# Altium project RC.PrjPcb
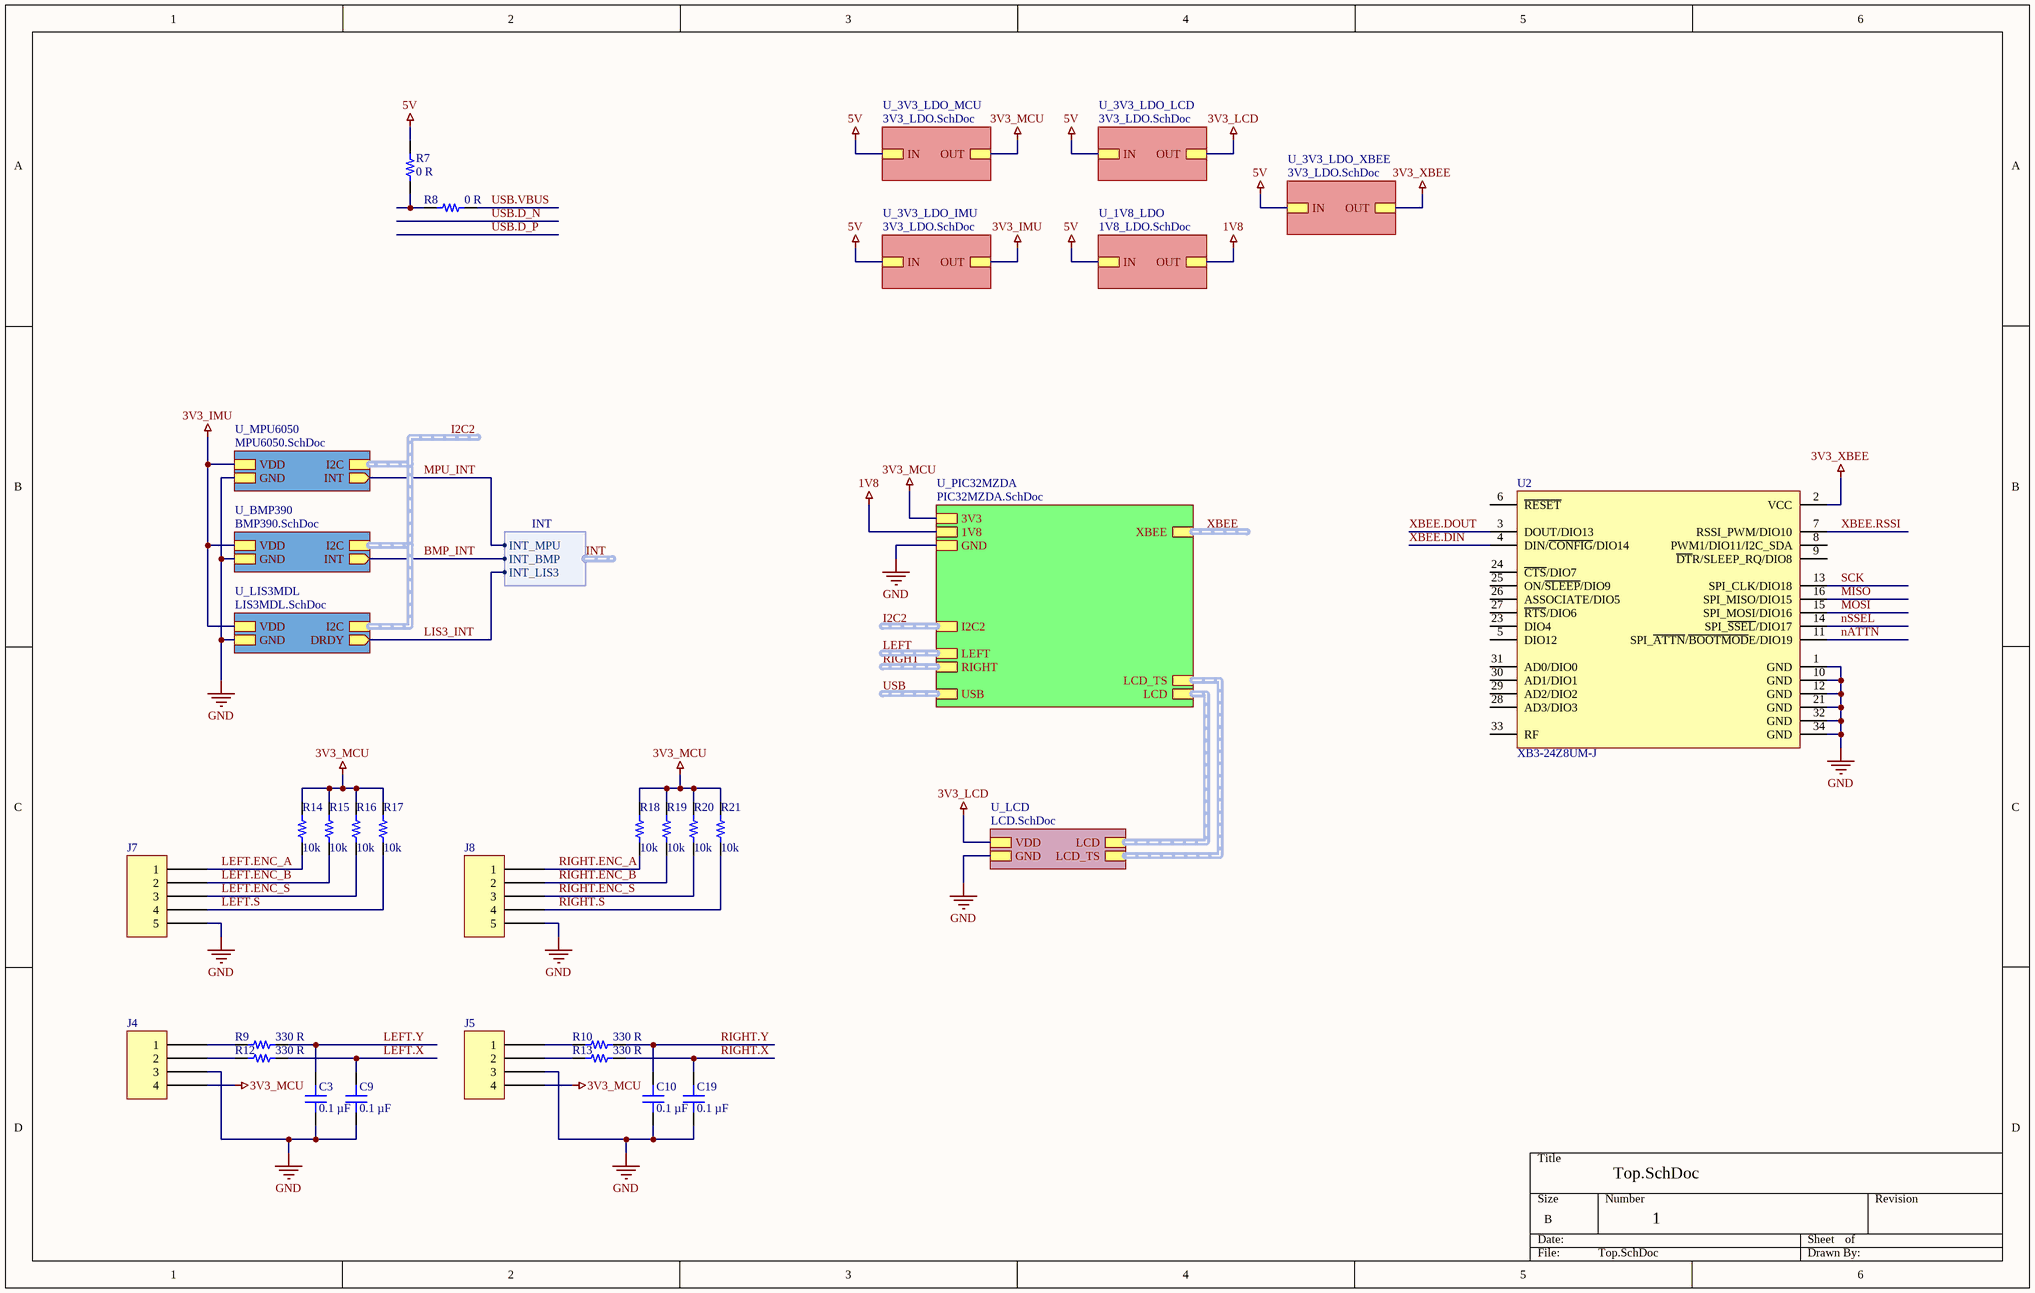
[diagram p0: Top.SchDoc]
5 sheets, 53 parts. Net scope: hierarchical (ports join the sheet entries above them; power ports are global).
Board file: RC.PcbDoc
Sheets:
  Top.SchDoc
    U_3V3_LDO_MCU = 3V3_LDO.SchDoc
    U_LCD = LCD.SchDoc
    U_3V3_LDO_LCD = 3V3_LDO.SchDoc
    U_MPU6050 = MPU6050.SchDoc
    U_3V3_LDO_IMU = 3V3_LDO.SchDoc
    U_3V3_LDO_XBEE = 3V3_LDO.SchDoc
  5V_BOOST.SchDoc

## Sheet Top.SchDoc
size B; SheetNumber: 1; SheetTotal: 9

### Parts
C3  0.1 µF  [CAP 0402_1005]
C9  0.1 µF  [CAP 0402_1005]
C10  0.1 µF  [CAP 0402_1005]
C19  0.1 µF  [CAP 0402_1005]
J4  BM04B-SRSS-TB(LF)(SN)  [JST BM04B-SRSS-TB]  (value not drawn)
J5  BM04B-SRSS-TB(LF)(SN)  [JST BM04B-SRSS-TB]  (value not drawn)
J7  SM05B-SRSS-TB(LF)(SN)  [JST SM05B-SRSS-TB]  (value not drawn)
J8  SM05B-SRSS-TB(LF)(SN)  [JST SM05B-SRSS-TB]  (value not drawn)
R7  0 R  [RES 0603_1608]
R8  0 R  [RES 0402_1005]
R9  330 R  [RES 0402_1005]
R10  330 R  [RES 0402_1005]
R12  330 R  [RES 0402_1005]
R13  330 R  [RES 0402_1005]
R14  10k  [RES 0402_1005]
R15  10k  [RES 0402_1005]
R16  10k  [RES 0402_1005]
R17  10k  [RES 0402_1005]
R18  10k  [RES 0402_1005]
R19  10k  [RES 0402_1005]
R20  10k  [RES 0402_1005]
R21  10k  [RES 0402_1005]
U2  XB3-24Z8UM-J  [XCVR_XB3-24Z8UM-J]

### Sub-sheets
U_1V8_LDO = 1V8_LDO.SchDoc (file not in this document): OUT, IN
U_3V3_LDO_IMU = 3V3_LDO.SchDoc: OUT, IN
U_3V3_LDO_LCD = 3V3_LDO.SchDoc: OUT, IN
U_3V3_LDO_MCU = 3V3_LDO.SchDoc: OUT, IN
U_3V3_LDO_XBEE = 3V3_LDO.SchDoc: OUT, IN
U_BMP390 = BMP390.SchDoc (file not in this document): VDD, GND, I2C (harness I2C), INT (out)
U_LCD = LCD.SchDoc: VDD, GND, LCD (harness LCD), LCD_TS (harness LCD_TS)
U_LIS3MDL = LIS3MDL.SchDoc (file not in this document): VDD, GND, I2C (harness I2C), DRDY (out)
U_MPU6050 = MPU6050.SchDoc: VDD, GND, I2C (harness I2C), INT (out)
U_PIC32MZDA = PIC32MZDA.SchDoc (file not in this document): 1V8, GND, 3V3, LCD (harness LCD), USB (harness USB), I2C2 (harness I2C), LCD_TS (harness LCD_TS), LEFT (harness INPUT), RIGHT (harness INPUT), XBEE (harness XBEE)

### Harnesses
INT: INT_MPU, INT_BMP, INT_LIS3

### Nets
1V8: sheet U_PIC32MZDA/1V8, sheet U_1V8_LDO/OUT
3V3_IMU: sheet U_MPU6050/VDD, sheet U_LIS3MDL/VDD, sheet U_BMP390/VDD, sheet U_3V3_LDO_IMU/OUT
3V3_LCD: sheet U_LCD/VDD, sheet U_3V3_LDO_LCD/OUT
3V3_MCU: J4.4 J5.4 R14.1 R15.1 R16.1 R17.1 R18.1 R19.1 R20.1 R21.1 ; sheet U_3V3_LDO_MCU/OUT, sheet U_PIC32MZDA/3V3
3V3_XBEE: U2.2(VCC) ; sheet U_3V3_LDO_XBEE/OUT
5V: R7.2 ; sheet U_3V3_LDO_MCU/IN, sheet U_3V3_LDO_LCD/IN, sheet U_1V8_LDO/IN, sheet U_3V3_LDO_IMU/IN, sheet U_3V3_LDO_XBEE/IN
GND: C3.1 C9.1 C10.1 C19.1 J4.3 J5.3 J7.5 J8.5 U2.1(GND) U2.10(GND) U2.12(GND) U2.21(GND) U2.32(GND) U2.34(GND) ; sheet U_PIC32MZDA/GND, sheet U_LCD/GND, sheet U_MPU6050/GND, sheet U_LIS3MDL/GND, sheet U_BMP390/GND
BMP_INT: sheet U_BMP390/INT, harness INT.INT_BMP
LEFT.ENC_A: J7.1 R14.2
LEFT.ENC_B: J7.2 R15.2
LEFT.ENC_S: J7.3 R16.2
LEFT.S: J7.4 R17.2
LEFT.X: C9.2 R12.1
LEFT.Y: C3.2 R9.1
LIS3_INT: sheet U_LIS3MDL/DRDY, harness INT.INT_LIS3  [project net INT.INT_LIS3]
MISO: U2.16(SPI_MISO/DIO15)
MOSI: U2.15(SPI_MOSI/DIO16)
MPU_INT: sheet U_MPU6050/INT, harness INT.INT_MPU  [project net INT.INT_MPU]
nATTN: U2.11(SPI_~{ATTN}/~{BOOTMOD}E/DIO19)
nSSEL: U2.14(SPI_~{SSEL}/DIO17)
RIGHT.ENC_A: J8.1 R18.2
RIGHT.ENC_B: J8.2 R19.2
RIGHT.ENC_S: J8.3 R20.2
RIGHT.S: J8.4 R21.2
RIGHT.X: C19.2 R13.1
RIGHT.Y: C10.2 R10.1
SCK: U2.13(SPI_CLK/DIO18)
USB.VBUS: R8.1
XBEE.DIN: U2.4(DIN/~{CONFIG}/DIO14)
XBEE.DOUT: U2.3(DOUT/DIO13)
XBEE.RSSI: U2.7(RSSI_PWM/DIO10)
NetJ4_1: J4.1 R9.2
NetJ4_2: J4.2 R12.2
NetJ5_1: J5.1 R10.2
NetJ5_2: J5.2 R13.2
NetR7_1: R7.1 R8.2

Not connected (* = marked no-connect by the designer): U2 5(DIO12) 6(~{RESET}) 8(PWM1/DIO11/I2C_SDA) 9(~{DT}R/SLEEP_RQ/DIO8) 23(DIO4) 24(~{CTS}/DIO7) 25(ON/~{SLEEP}/DIO9) 26(ASSOCIATE/DIO5) 27(~{RTS}/DIO6) 28(AD3/DIO3) 29(AD2/DIO2) 30(AD1/DIO1) 31(AD0/DIO0) 33(RF)

### Buses and harness runs
harness I2C2 = sheet U_BMP390/I2C = sheet U_LIS3MDL/I2C = sheet U_MPU6050/I2C
harness I2C2 = sheet U_PIC32MZDA/I2C2
harness LEFT = sheet U_PIC32MZDA/LEFT
harness RIGHT = sheet U_PIC32MZDA/RIGHT
harness sheet U_LCD/LCD = sheet U_PIC32MZDA/LCD
harness sheet U_LCD/LCD_TS = sheet U_PIC32MZDA/LCD_TS
harness USB = sheet U_PIC32MZDA/USB
harness XBEE = sheet U_PIC32MZDA/XBEE

### Library data of the parts
C3 C9 C10 C19 = C0402C104K4RACAUTO: CAP CER 0.1UF 16V X7R 0402; manufacturer: KEMET; Tolerance: ±10%; Part Number: C0402C104K4RACAUTO; Value: 0.1 µF; Applications: Automotive, Bypass, Decoupling; Capacitance: 0.1 µF; componentlink1description: Datasheet; componentlink1url: https://api.kemet.com/component-edge/download/specsheet/C0402C104K4RACAUTO.pdf; componentlink2description: DigiKey Link; componentlink2url: https://www.digikey.com/en/products/detail/kemet/C0402C104K4RACAUTO/3314827; Device Package: 0402 (1005 Metric); lastupdated: 8/14/2022 9:05:51 PM; Lifecycle Status: Active; Minimum Order: 1; Mounting Type: Surface Mount, MLCC; Operating Temperature: -55°C ~ 125°C; Package / Case: 0402 (1005 Metric); packaging: TapeAndReel; partid: 3024; Part Status: Active; price: 0.01; Ratings: AEC-Q200; series: SMD Auto X7R; Size / Dimension: 0.039" L x 0.020" W (1.00mm x 0.50mm); Supplier 1: DigiKey; Supplier Part Number 1: 399-6828-1-ND; Temperature Coefficient: X7R; Thickness (Max): 0.022" (0.55mm); Voltage - Rated: 16V
J4 J5 = BM04B-SRSS-TB(LF)(SN): CONN HEADER SMD 4POS 1MM; Manufacturer: JST Sales America Inc.; Current Rating (Amps): 0.7A; Material Flammability Rating: UL94 V-0; Number of Positions: 4; Number of Positions Loaded: All; Pitch - Mating: 0.039" (1.00mm); Row Spacing - Mating: -25°C ~ 85°C; Shrouding: Shrouded - 4 Wall; Style: Board to Cable/Wire; Voltage Rating: 50V; Part Number: BM04B-SRSS-TB(LF)(SN); ComponentLink1Description: Datasheet; ComponentLink1URL: http://www.jst-mfg.com/product/pdf/eng/eSH.pdf; ComponentLink2Description: DigiKey Link; ComponentLink2URL: http://digikey.com/product-detail/en/jst-sales-america-inc/BM04B-SRSS-TB-LF-SN/455-1790-1-ND/926861; Connector Type: Header; Contact Finish - Mating: Tin; Contact Finish - Post: Tin; Contact Material: Copper Alloy; Contact Shape: Square; Contact Type: Male Pin; Fastening Type: Push-Pull; Features: Solder Retention; Insulation Color: Natural; Insulation Height: 0.167" (4.25mm); Insulation Material: Polyamide (PA), Nylon; LastUpdated: 8/24/2020 1:45:53 PM; Lifecycle Status: Active; Minimum Order: 1; Mounting Type: Surface Mount; Number of Rows: 1; Operating Temperature: -25°C ~ 85°C; Packaging: TapeAndReel; PartId: 16; Part Status: Active; Price: 0.29; Series: SR; Supplier 1: DigiKey; Supplier Part Number 1: 455-1790-1-ND; Termination: Solder
J7 J8 = SM05B-SRSS-TB(LF)(SN): CONN HEADER SMD R/A 5POS 1MM; Manufacturer: JST Sales America Inc.; Current Rating (Amps): 0.7A; Material Flammability Rating: UL94 V-0; Number of Positions: 5; Number of Positions Loaded: All; Pitch - Mating: 0.039" (1.00mm); Shrouding: Shrouded - 4 Wall; Style: Board to Cable/Wire; Voltage Rating: 50V; Part Number: SM05B-SRSS-TB(LF)(SN); ComponentLink1Description: Datasheet; ComponentLink1URL: http://www.jst-mfg.com/product/pdf/eng/eSH.pdf; ComponentLink2Description: DigiKey Link; ComponentLink2URL: http://digikey.com/product-detail/en/jst-sales-america-inc/SM05B-SRSS-TB-LF-SN/455-1805-1-ND/926876; Connector Type: Header; Contact Finish - Mating: Tin; Contact Finish - Post: Tin; Contact Material: Copper Alloy; Contact Shape: Square; Contact Type: Male Pin; Fastening Type: Push-Pull; Features: Solder Retention; Insulation Color: Natural; Insulation Height: 0.114" (2.90mm); Insulation Material: Polyamide (PA), Nylon; LastUpdated: 1/12/2020 11:42:04 PM; Lifecycle Status: Active; Minimum Order: 1; Mounting Type: Surface Mount, Right Angle; Number of Rows: 1; Operating Temperature: -25°C ~ 85°C; Packaging: TapeAndReel; PartId: 63; Part Status: Active; Price: 0.32; Series: SR; Supplier 1: DigiKey; Supplier Part Number 1: 455-1805-1-ND; Termination: Solder
R7 = RNCS0603BKE10K0: RES 10K OHM 0.1% 1/16W 0603; Manufacturer: Stackpole Electronics Inc; Power (Watts): 0.063W, 1/16W; Resistance: 10 kOhms; Temperature Coefficient: ±25ppm/°C; Part Number: RNCS0603BKE10K0; Value: 0 R; ComponentLink1Description: Datasheet; ComponentLink1URL: https://www.seielect.com/catalog/sei-rncs_rnch.pdf; ComponentLink2Description: DigiKey Link; ComponentLink2URL: https://www.digikey.com/en/products/detail/stackpole-electronics-inc/RNCS0603BKE10K0/1708836; Composition: Thin Film; Device Package: 0603 (1608 Metric); Features: Anti-Corrosive, Automotive AEC-Q200, Moisture Resistant; Height - Seated (Max): 0.022" (0.55mm); LastUpdated: 9/19/2022 1:22:34 PM; Lifecycle Status: Active; Minimum Order: 1; Number of Terminations: 2; Operating Temperature: -55°C ~ 155°C; Package / Case: 0603 (1608 Metric); Packaging: TapeAndReel; PartId: 4838; Part Status: Active; Price: 0.07; Ratings: AEC-Q200; Series: RNCS; Size / Dimension: 0.061" L x 0.031" W (1.55mm x 0.80mm); Supplier 1: DigiKey; Supplier Part Number 1: RNCS0603BKE10K0CT-ND; Supplier Device Package: 0603; Tolerance: ±0.1%
R8-R10 R12-R21 = CRCW0402330RJNEDC: RES 330 OHM 5% 1/16W 0402; Manufacturer: Vishay Dale; Power (Watts): 0.063W, 1/16W; Resistance: 330 Ohms; Temperature Coefficient: ±200ppm/°C; Part Number: CRCW0402330RJNEDC; ComponentLink1Description: Datasheet; ComponentLink1URL: http://www.vishay.com/docs/28773/crcwce3.pdf; ComponentLink2Description: DigiKey Link; ComponentLink2URL: https://www.digikey.com/en/products/detail/vishay-dale/CRCW0402330RJNEDC/7928545; Composition: Thick Film; Device Package: 0402 (1005 Metric); Height - Seated (Max): 0.014" (0.35mm); LastUpdated: 8/14/2022 9:23:31 PM; Lifecycle Status: Active; Minimum Order: 1; Number of Terminations: 2; Operating Temperature: -55°C ~ 155°C; Package / Case: 0402 (1005 Metric); Packaging: CutTape; PartId: 15989; Part Status: Active; Price: 0.01; Series: CRCW-C; Size / Dimension: 0.039" L x 0.020" W (1.00mm x 0.50mm); Supplier 1: DigiKey; Supplier Part Number 1: 541-4123-1-ND; Supplier Device Package: 0402; Tolerance: ±5%
  R8: Value: 0 R
  R9 R10 R12 R13: Value: 330 R
  R14-R21: Value: 10k
U2 = XB3-24Z8UM-J: 802.15.4 Zigbee Transceiver Module 2.4GHz Antenna Not Included, U.FL Surface Mount; MF: Digi International; Availability: Unavailable; MP: XB3-24Z8UM-J; Value: *; SnapEDA_Link: https://www.snapeda.com/parts/XB3-24Z8UM-J/Digi%20International/view-part/2762908/?ref=snap; Price: None; Package: SMD-34 Digi International

## Sheet 3V3_LDO.SchDoc
size A; SheetNumber: 3; SheetTotal: 9
Used 4 times, as channels U_3V3_LDO_MCU, U_3V3_LDO_LCD, U_3V3_LDO_IMU, U_3V3_LDO_XBEE. Parts and nets are listed once, with the designators drawn on the sheet.
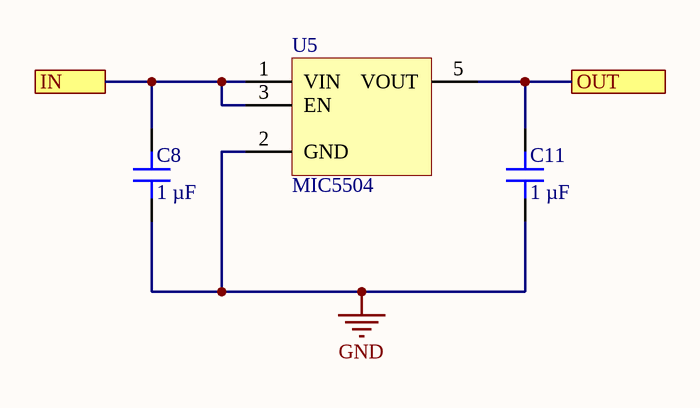
[diagram p1: 3V3_LDO.SchDoc]

### Parts
C8  1 µF  [CAP 0402_1005]
C11  1 µF  [CAP 0402_1005]
U5  MIC5504  [TI SOT-23-5 DBV]

### Ports
IN, OUT

### Nets
GND: C8.1 C11.1 U5.2(GND)
IN: C8.2 U5.1(VIN) U5.3(EN) ; port IN
OUT: C11.2 U5.5(VOUT) ; port OUT

### Channels
U_3V3_LDO_MCU: designators end in _2#1; ports IN=5V OUT=3V3_MCU
U_3V3_LDO_LCD: designators end in _2#2; ports IN=5V OUT=3V3_LCD
U_3V3_LDO_IMU: designators end in _1; ports IN=5V OUT=3V3_IMU
U_3V3_LDO_XBEE: designators end in _4; ports IN=5V OUT=3V3_XBEE

### Library data of the parts
C8 C11 = C0402C104K4RACAUTO: CAP CER 0.1UF 16V X7R 0402; manufacturer: KEMET; Capacitance: 0.1 µF; Tolerance: ±10%; Part Number: C0402C104K4RACAUTO; Value: 1 µF; Applications: Automotive, Bypass, Decoupling; componentlink1description: Datasheet; componentlink1url: https://api.kemet.com/component-edge/download/specsheet/C0402C104K4RACAUTO.pdf; componentlink2description: DigiKey Link; componentlink2url: https://www.digikey.com/en/products/detail/kemet/C0402C104K4RACAUTO/3314827; Device Package: 0402 (1005 Metric); lastupdated: 8/14/2022 9:05:51 PM; Lifecycle Status: Active; Minimum Order: 1; Mounting Type: Surface Mount, MLCC; Operating Temperature: -55°C ~ 125°C; Package / Case: 0402 (1005 Metric); packaging: TapeAndReel; partid: 3024; Part Status: Active; price: 0.01; Ratings: AEC-Q200; series: SMD Auto X7R; Size / Dimension: 0.039" L x 0.020" W (1.00mm x 0.50mm); Supplier 1: DigiKey; Supplier Part Number 1: 399-6828-1-ND; Temperature Coefficient: X7R; Thickness (Max): 0.022" (0.55mm); Voltage - Rated: 16V
U5 = MIC5504-3.3YM5: 3.3V LDO

## Sheet LCD.SchDoc
size A; SheetNumber: 7; SheetTotal: 9
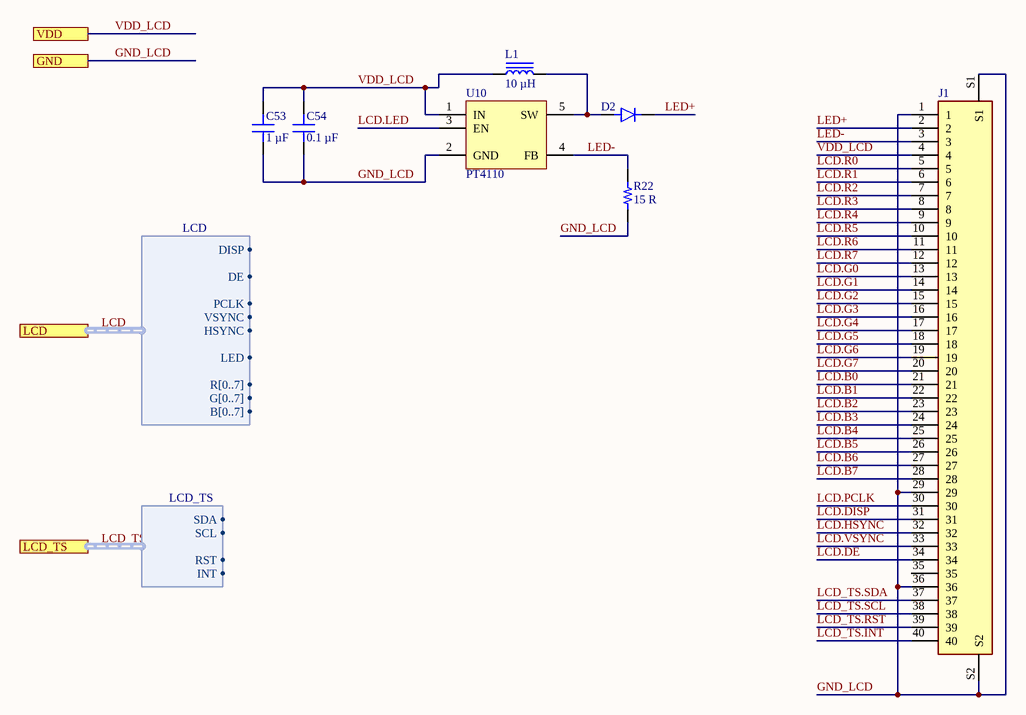
[diagram p2: LCD.SchDoc]

### Parts
C53  1 µF  [CAP 0402_1005]
C54  0.1 µF  [CAP 0402_1005]
D2  Diode  [Diode DFN1608D-2 (SOD1608)]  (value not drawn)
J1  40pin_0.5mm_ZIF  [40pin_0.5mmPitch]  (value not drawn)
L1  10 µH  [IND 0806_2016]
R22  15 R  [RES 0603_1608]
U10  PT4110  [SOT-89-5]

### Ports
GND, LCD (harness LCD), LCD_TS (harness LCD_TS), VDD

### Harnesses
LCD: PCLK, DISP, VSYNC, HSYNC, DE, LED, R[0..7], G[0..7], B[0..7]
LCD_TS: INT, RST, SCL, SDA

### Nets
GND_LCD: C53.1 C54.1 J1.1 J1.29 J1.36 J1.S1 J1.S2 R22.2 U10.2(GND) ; port GND  [project net GND]
VDD_LCD: C53.2 C54.2 J1.4 L1.1 U10.1(IN) ; port VDD  [project net 3V3_LCD]
LCD.B0: J1.21
LCD.B1: J1.22
LCD.B2: J1.23
LCD.B3: J1.24
LCD.B4: J1.25
LCD.B5: J1.26
LCD.B6: J1.27
LCD.B7: J1.28
LCD.DE: J1.34
LCD.DISP: J1.31
LCD.G0: J1.13
LCD.G1: J1.14
LCD.G2: J1.15
LCD.G3: J1.16
LCD.G4: J1.17
LCD.G5: J1.18
LCD.G6: J1.19
LCD.G7: J1.20
LCD.HSYNC: J1.32
LCD.LED: U10.3(EN)
LCD.PCLK: J1.30
LCD.R0: J1.5
LCD.R1: J1.6
LCD.R2: J1.7
LCD.R3: J1.8
LCD.R4: J1.9
LCD.R5: J1.10
LCD.R6: J1.11
LCD.R7: J1.12
LCD.VSYNC: J1.33
LCD_TS.INT: J1.40
LCD_TS.RST: J1.39
LCD_TS.SCL: J1.38
LCD_TS.SDA: J1.37
LED+: D2.1(A) J1.2
LED-: J1.3 R22.1 U10.4(FB)
NetD2_2: D2.2(BLUE(C)) L1.2 U10.5(SW)

Not connected (* = marked no-connect by the designer): J1 35

### Buses and harness runs
harness LCD = port LCD
harness LCD_TS = port LCD_TS

### Library data of the parts
C53 = C0402C104K4RACAUTO: as C8 on sheet 3V3_LDO; Part Number: C0402C104K4RACAUTO; Value: 1 µF; Applications: Automotive, Bypass, Decoupling; componentlink1description: Datasheet; componentlink1url: https://api.kemet.com/component-edge/download/specsheet/C0402C104K4RACAUTO.pdf; componentlink2description: DigiKey Link; componentlink2url: https://www.digikey.com/en/products/detail/kemet/C0402C104K4RACAUTO/3314827; Device Package: 0402 (1005 Metric); lastupdated: 8/14/2022 9:05:51 PM; Lifecycle Status: Active; Minimum Order: 1; Mounting Type: Surface Mount, MLCC; Operating Temperature: -55°C ~ 125°C; Package / Case: 0402 (1005 Metric); packaging: TapeAndReel; partid: 3024; Part Status: Active; price: 0.01; Ratings: AEC-Q200; series: SMD Auto X7R; Size / Dimension: 0.039" L x 0.020" W (1.00mm x 0.50mm); Supplier 1: DigiKey; Supplier Part Number 1: 399-6828-1-ND; Temperature Coefficient: X7R; Thickness (Max): 0.022" (0.55mm); Voltage - Rated: 16V
C54 = C0402C104K4RACAUTO: as C3 on sheet Top; Part Number: C0402C104K4RACAUTO; Value: 0.1 µF; Applications: Automotive, Bypass, Decoupling; Capacitance: 0.1 µF; componentlink1description: Datasheet; componentlink1url: https://api.kemet.com/component-edge/download/specsheet/C0402C104K4RACAUTO.pdf; componentlink2description: DigiKey Link; componentlink2url: https://www.digikey.com/en/products/detail/kemet/C0402C104K4RACAUTO/3314827; Device Package: 0402 (1005 Metric); lastupdated: 8/14/2022 9:05:51 PM; Lifecycle Status: Active; Minimum Order: 1; Mounting Type: Surface Mount, MLCC; Operating Temperature: -55°C ~ 125°C; Package / Case: 0402 (1005 Metric); packaging: TapeAndReel; partid: 3024; Part Status: Active; price: 0.01; Ratings: AEC-Q200; series: SMD Auto X7R; Size / Dimension: 0.039" L x 0.020" W (1.00mm x 0.50mm); Supplier 1: DigiKey; Supplier Part Number 1: 399-6828-1-ND; Temperature Coefficient: X7R; Thickness (Max): 0.022" (0.55mm); Voltage - Rated: 16V
D2 = Diode: DFN1608D-2 (SOD1608); Manufacturer: Cree; ComponentLink2Description: Datasheet; Temperature: -40°C to +100°C; Package: LED_3MM2X2MM8; Supplier 2: Mouser; Price: 0.203999996142; Supplier 1: Digi-Key; ComponentLink1URL: https://upverter.com/upn/revision/9d0b31f7b1982705/; Supplier Part Number 2: 941-CLV1LFKBC7673673; Supplier Part Number 1: CLV1L-FKB-CHMMQEHBB7673673-ND; ComponentLink1Description: Upverter; ComponentLink2URL: http://www.cree.com/~/media/Files/Cree/LED-Components-and-Modules/HB/Data-Sheets/CLV1L-FKB-1238.pdf; RoHS: TRUE; Mouser Part Number: 941-CLV1LFKBC7673673; Temperature Range High: +100°C; Digikey Description: DIODE LED RGB DIFFUSED 4LCC SMD; Digikey Part Number: CLV1L-FKB-CHMMQEHBB7673673-ND; Lead Free: yes; Temperature Range Low: -40°C
J1 = 40pin_0.5mm_ZIF: 40 Position FFC, FPC Connector Contacts, Top 0.020 _0.50mm_ Surface Mount, Right Angle; MP: FH12A-40S-0.5SH_55_; MF: Hirose; Price: None; SnapEDA_Link: https://www.snapeda.com/parts/FH12A-40S-0.5SH%2855%29/Hirose%20Electric%20Co%20Ltd/view-part/447132/?ref=snap; Package: None; Availability: Unavailable; Value: *
L1 = TYA201610100M-10: FIXED IND 10UH 600MA 875MOHM SMD; Manufacturer: Laird-Signal Integrity Products; DC Resistance (DCR): 875mOhm Max; Inductance Frequency - Test: 1 MHz; Material - Core: Metal; Shielding: Shielded; Tolerance: ±20%; Type: Drum Core, Wirewound; Part Number: TYA201610100M-10; ComponentLink1Description: Datasheet; ComponentLink1URL: https://www.laird.com/sites/default/files/2020-05/TYA201610%20series%20%28Rev%20A%29.pdf; ComponentLink2Description: DigiKey Link; ComponentLink2URL: https://www.digikey.com/en/products/detail/laird-signal-integrity-products/TYA201610100M-10/12664143; Current Rating (Amps): 600 mA; Device Package: 0806 (2016 Metric); Height - Seated (Max): 0.045" (1.15mm); Inductance: 10 µH; LastUpdated: 9/19/2022 1:59:27 PM; Lifecycle Status: Active; Minimum Order: 1; Mounting Type: Surface Mount; Operating Temperature: -40°C ~ 125°C; Package / Case: 0806 (2016 Metric); Packaging: TapeAndReel; PartId: 5377; Part Status: Active; Price: 0.12; Ratings: AEC-Q200; Series: TYA201610; Size / Dimension: 0.079" L x 0.063" W (2.00mm x 1.60mm); Supplier 1: DigiKey; Supplier Part Number 1: 240-TYA201610100M-10CT-ND; Supplier Device Package: 0806; Value: 10 µH
R22 = RNCS0603BKE10K0: as R7 on sheet Top; Part Number: RNCS0603BKE10K0; Value: 15 R; ComponentLink1Description: Datasheet; ComponentLink1URL: https://www.seielect.com/catalog/sei-rncs_rnch.pdf; ComponentLink2Description: DigiKey Link; ComponentLink2URL: https://www.digikey.com/en/products/detail/stackpole-electronics-inc/RNCS0603BKE10K0/1708836; Composition: Thin Film; Device Package: 0603 (1608 Metric); Features: Anti-Corrosive, Automotive AEC-Q200, Moisture Resistant; Height - Seated (Max): 0.022" (0.55mm); LastUpdated: 9/19/2022 1:22:34 PM; Lifecycle Status: Active; Minimum Order: 1; Number of Terminations: 2; Operating Temperature: -55°C ~ 155°C; Package / Case: 0603 (1608 Metric); Packaging: TapeAndReel; PartId: 4838; Part Status: Active; Price: 0.07; Ratings: AEC-Q200; Series: RNCS; Size / Dimension: 0.061" L x 0.031" W (1.55mm x 0.80mm); Supplier 1: DigiKey; Supplier Part Number 1: RNCS0603BKE10K0CT-ND; Supplier Device Package: 0603; Tolerance: ±0.1%
U10 = PT4110: LED Backlight Driver

## Sheet MPU6050.SchDoc
size A; SheetNumber: 4; SheetTotal: 9
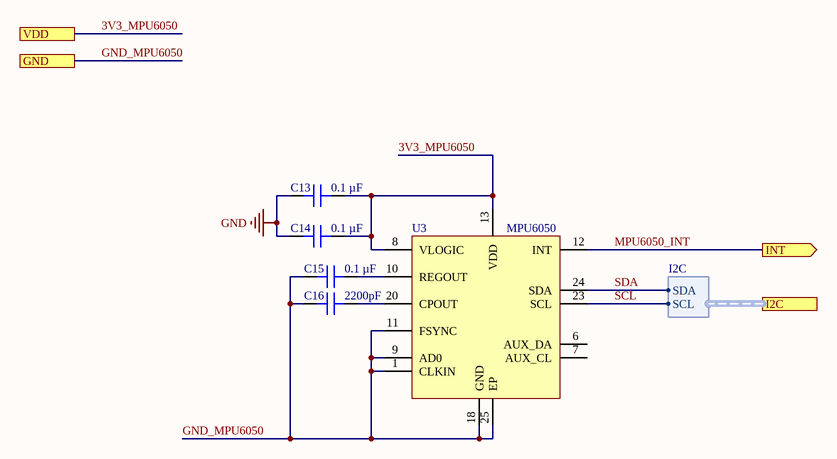
[diagram p3: MPU6050.SchDoc]

### Parts
C13  0.1 µF  [CAP 0402_1005]
C14  0.1 µF  [CAP 0402_1005]
C15  0.1 µF  [CAP 0402_1005]
C16  2200pF  [CAP 0603_1608]
U3  MPU6050  [IC_MPU6050]

### Ports
GND, I2C (harness I2C), INT (out), VDD

### Harnesses
I2C: SCL, SDA

### Nets
3V3_MPU6050: C13.1 C14.1 U3.8(VLOGIC) U3.13(VDD) ; port VDD  [project net 3V3_IMU]
GND: C13.2 C14.2 C15.2 C16.2 U3.1(CLKIN) U3.9(AD0) U3.11(FSYNC) U3.18(GND) U3.25(EP) ; port GND  [also labelled GND_MPU6050]
MPU6050_INT: U3.12(INT) ; port INT  [project net INT.INT_MPU]
SCL: U3.23(SCL) ; port I2C.SCL  [project net I2C2.SCL]
SDA: U3.24(SDA) ; port I2C.SDA  [project net I2C2.SDA]
NetC15_1: C15.1 U3.10(REGOUT)
NetC16_1: C16.1 U3.20(CPOUT)

Not connected (* = marked no-connect by the designer): U3 6(AUX_DA) 7(AUX_CL)

### Library data of the parts
C13-C15 = C0402C104K4RACAUTO: as C3 on sheet Top; Part Number: C0402C104K4RACAUTO; Value: 0.1 µF; Applications: Automotive, Bypass, Decoupling; Capacitance: 0.1 µF; componentlink1description: Datasheet; componentlink1url: https://api.kemet.com/component-edge/download/specsheet/C0402C104K4RACAUTO.pdf; componentlink2description: DigiKey Link; componentlink2url: https://www.digikey.com/en/products/detail/kemet/C0402C104K4RACAUTO/3314827; Device Package: 0402 (1005 Metric); lastupdated: 8/14/2022 9:05:51 PM; Lifecycle Status: Active; Minimum Order: 1; Mounting Type: Surface Mount, MLCC; Operating Temperature: -55°C ~ 125°C; Package / Case: 0402 (1005 Metric); packaging: TapeAndReel; partid: 3024; Part Status: Active; price: 0.01; Ratings: AEC-Q200; series: SMD Auto X7R; Size / Dimension: 0.039" L x 0.020" W (1.00mm x 0.50mm); Supplier 1: DigiKey; Supplier Part Number 1: 399-6828-1-ND; Temperature Coefficient: X7R; Thickness (Max): 0.022" (0.55mm); Voltage - Rated: 16V
C16 = CGA3E2X8R1H222M080AD: CAP CER 2200PF 50V 0603 EPOXY; Manufacturer: TDK Corporation; Temperature Coefficient: X8R; Tolerance: ±20%; Part Number: CGA3E2X8R1H222M080AD; Value: 2200pF; Applications: Automotive; Capacitance: 2200pF; ComponentLink1Description: Datasheet; ComponentLink1URL: https://product.tdk.com/info/en/catalog/datasheets/mlcc_automotive_epoxy_en.pdf?ref_disty=digikey; ComponentLink2Description: DigiKey Link; ComponentLink2URL: http://digikey.com/product-detail/en/tdk-corporation/CGA3E2X8R1H222M080AD/445-9890-1-ND/3931817; Device Package: 0603 (1608 Metric); Features: Epoxy Mountable; LastUpdated: 13-Aug-20 10:19:25 AM; Lifecycle Status: Active; Minimum Order: 1; Mounting Type: Surface Mount, MLCC, Epoxy; Operating Temperature: -55°C ~ 150°C; Package / Case: 0603 (1608 Metric); Packaging: TapeAndReel; PartId: 17643; Part Status: Active; Price: 0.05; Ratings: AEC-Q200; Series: CGA; Size / Dimension: 0.063" L x 0.031" W (1.60mm x 0.80mm); Supplier 1: DigiKey; Supplier Part Number 1: 445-9890-1-ND; Thickness (Max): 0.031" (0.80mm)

## Sheet 5V_BOOST.SchDoc
size A; SheetNumber: 8; SheetTotal: 9
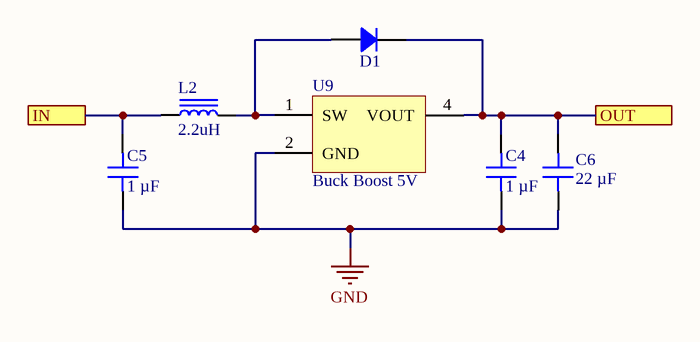
[diagram p4: 5V_BOOST.SchDoc]

### Parts
C4  1 µF  [CAP 0402_1005]
C5  1 µF  [CAP 0402_1005]
C6  22 µF  [CAP 0805_2012]
D1  V1F6-M3/H  [SMF DO-219AB]  (value not drawn)
L2  2.2uH  [TAIYO YUDEN MAMK2520T1R0M]
U9  Buck Boost 5V  [TI SOT-23-5 DBV]

### Ports
IN, OUT

### Nets
GND: C4.1 C5.1 C6.1 U9.2(GND)
IN: C5.2 L2.1 ; port IN
OUT: C4.2 C6.2 D1.2 U9.4(VOUT) ; port OUT
NetD1_1: D1.1 L2.2 U9.1(SW)

### Library data of the parts
C4 C5 = C0402C104K4RACAUTO: as C8 on sheet 3V3_LDO; Part Number: C0402C104K4RACAUTO; Value: 1 µF; Applications: Automotive, Bypass, Decoupling; componentlink1description: Datasheet; componentlink1url: https://api.kemet.com/component-edge/download/specsheet/C0402C104K4RACAUTO.pdf; componentlink2description: DigiKey Link; componentlink2url: https://www.digikey.com/en/products/detail/kemet/C0402C104K4RACAUTO/3314827; Device Package: 0402 (1005 Metric); lastupdated: 8/14/2022 9:05:51 PM; Lifecycle Status: Active; Minimum Order: 1; Mounting Type: Surface Mount, MLCC; Operating Temperature: -55°C ~ 125°C; Package / Case: 0402 (1005 Metric); packaging: TapeAndReel; partid: 3024; Part Status: Active; price: 0.01; Ratings: AEC-Q200; series: SMD Auto X7R; Size / Dimension: 0.039" L x 0.020" W (1.00mm x 0.50mm); Supplier 1: DigiKey; Supplier Part Number 1: 399-6828-1-ND; Temperature Coefficient: X7R; Thickness (Max): 0.022" (0.55mm); Voltage - Rated: 16V
C6 = GRM21BC81A226ME44L: CAP CER 22UF 10V X6S 0805; manufacturer: Murata Electronics; Tolerance: ±20%; Part Number: GRM21BC81A226ME44L; Value: 22 µF; Applications: General Purpose; Capacitance: 22 µF; componentlink1description: Datasheet; componentlink1url: https://search.murata.co.jp/Ceramy/image/img/A01X/G101/ENG/GRM21BC81A226ME44-01.pdf; componentlink2description: DigiKey Link; componentlink2url: https://www.digikey.com/en/products/detail/murata-electronics/GRM21BC81A226ME44L/4905507; Device Package: 0805 (2012 Metric); lastupdated: 9/19/2022 1:04:08 PM; Lifecycle Status: Active; Minimum Order: 1; Mounting Type: Surface Mount, MLCC; Operating Temperature: -55°C ~ 105°C; Package / Case: 0805 (2012 Metric); packaging: TapeAndReel; partid: 10035; Part Status: Active; price: 0.10; series: GRM; Size / Dimension: 0.079" L x 0.049" W (2.00mm x 1.25mm); Supplier 1: DigiKey; Supplier Part Number 1: 490-14657-1-ND; Temperature Coefficient: X6S; Thickness (Max): 0.057" (1.45mm); Voltage - Rated: 10V
D1 = V1F6-M3/H: 1A 60V SMF TRENCH SKY RECT; Manufacturer: Vishay Semiconductor Diodes Division; Capacitance @ Vr, F: 135pF @ 4V, 1MHz; Current - Reverse Leakage @ Vr: 270µA @ 60V; Diode Type: Schottky; Speed: Fast Recovery =< 500ns, > 200mA (Io); Voltage - Forward (Vf) (Max) @ If: 600mV @ 1A; Part Number: V1F6-M3/H; ComponentLink1Description: Datasheet; ComponentLink1URL: http://www.vishay.com/docs/87555/v1f6.pdf; ComponentLink2Description: DigiKey Link; ComponentLink2URL: http://digikey.com/product-detail/en/vishay-semiconductor-diodes-division/V1F6-M3-H/112-V1F6-M3-HCT-ND/10660586; Current - Average Rectified (Io): 1A; LastUpdated: 02-Sep-20 1:23:13 AM; Lifecycle Status: Active; Minimum Order: 1; Mounting Type: Surface Mount; Operating Temperature - Junction: -40°C ~ 150°C; Package / Case: DO-219AB; Packaging: Unknown; PartId: 3272; Part Status: Active; Price: 0.07; Series: eSMP®, TMBS®; Supplier 1: DigiKey; Supplier Part Number 1: 112-V1F6-M3/HCT-ND; Supplier Device Package: DO-219AB (SMF); Voltage - DC Reverse (Vr) (Max): 60V
L2 = MAKK2520TR47M: FIXED IND 470NH 3.2A 46 MOHM SMD; Manufacturer: Taiyo Yuden; Current - Saturation: 3.9A; DC Resistance (DCR): 46mOhm Max; Inductance Frequency - Test: 2MHz; Material - Core: Metal; Shielding: Shielded; Tolerance: ±20%; Type: Wirewound; Part Number: MAKK2520TR47M; ComponentLink1Description: Datasheet; ComponentLink1URL: https://ds.yuden.co.jp/TYCOMPAS/ut/detail?pn=MAKK2520TR47M  &u=M; ComponentLink2Description: DigiKey Link; ComponentLink2URL: http://digikey.com/product-detail/en/taiyo-yuden/MAKK2520TR47M/587-4145-1-ND/5035305; Current Rating (Amps): 3.2A; Device Package: 1008 (2520 Metric); Height - Seated (Max): 0.039" (1.00mm); Inductance: 470nH; LastUpdated: 9/2/2020 1:22:11 AM; Lifecycle Status: Active; Minimum Order: 1; Mounting Type: Surface Mount; Operating Temperature: -40°C ~ 105°C; Package / Case: 1008 (2520 Metric); Packaging: TapeAndReel; PartId: 69; Part Status: Active; Price: 0.09; Series: MCOIL™, MA; Size / Dimension: 0.098" L x 0.079" W (2.50mm x 2.00mm); Supplier 1: DigiKey; Supplier Part Number 1: 587-4145-1-ND; Supplier Device Package: 1008 (2520 Metric); Value: 470nH
U9 = TPS613222A: ADJ step down Buck

## Nets that join several sheets
3V3_IMU: MPU6050 (C13.1 C14.1 U3.8 U3.13), U_3V3_LDO_IMU (C11_1.2 U5_1.5)
3V3_LCD: LCD (5 pins), U_3V3_LDO_LCD (C11_2#2.2 U5_2#2.5)
3V3_MCU: Top (10 pins), U_3V3_LDO_MCU (C11_2#1.2 U5_2#1.5)
3V3_XBEE: Top (U2.2), U_3V3_LDO_XBEE (C11_4.2 U5_4.5)
5V: Top (R7.2), U_3V3_LDO_MCU (C8_2#1.2 U5_2#1.1 U5_2#1.3), U_3V3_LDO_LCD (C8_2#2.2 U5_2#2.1 U5_2#2.3), U_3V3_LDO_IMU (C8_1.2 U5_1.1 U5_1.3), U_3V3_LDO_XBEE (C8_4.2 U5_4.1 U5_4.3)
GND: Top (14 pins), U_3V3_LDO_MCU (C8_2#1.1 C11_2#1.1 U5_2#1.2), LCD (9 pins), U_3V3_LDO_LCD (C8_2#2.1 C11_2#2.1 U5_2#2.2), MPU6050 (9 pins), U_3V3_LDO_IMU (C8_1.1 C11_1.1 U5_1.2), U_3V3_LDO_XBEE (C8_4.1 C11_4.1 U5_4.2), 5V_BOOST (C4.1 C5.1 C6.1 U9.2)

## Assembly variants
Main: not fitted R7 R7